# Altium schematic sheet main.SchDoc
size A4
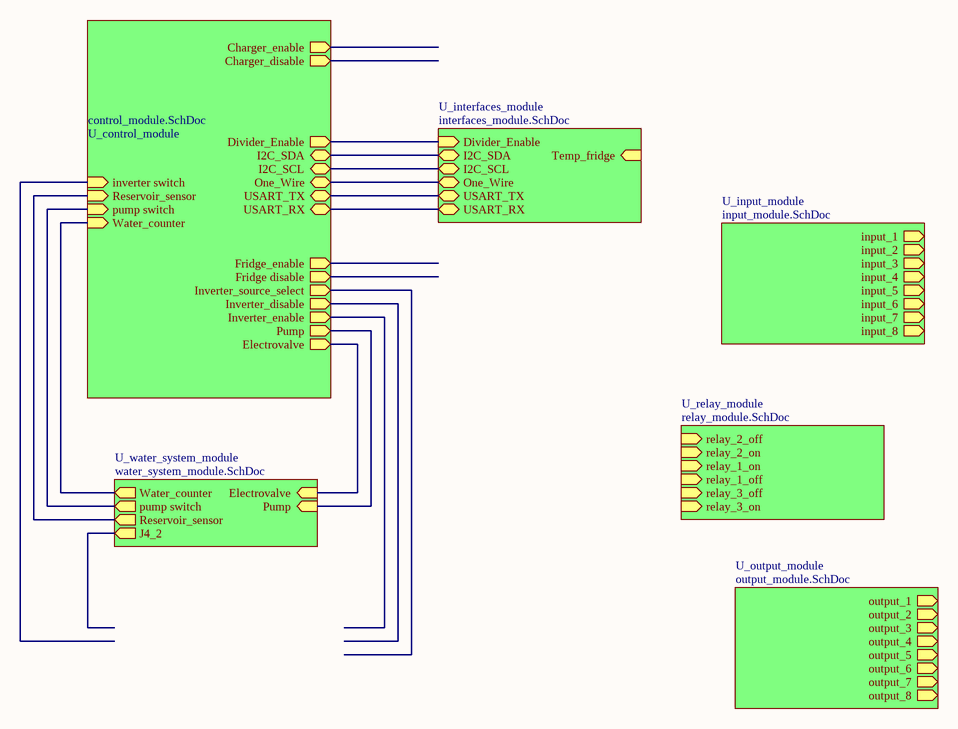
[diagram p0: main.SchDoc]

## Sub-sheets
U_control_module = control_module.SchDoc: Inverter_source_select (out), Inverter_enable (out), Fridge_enable (out), Water_counter (in), Inverter_disable (out), Fridge disable (out), I2C_SDA (bidir), USART_RX (bidir), USART_TX (bidir), pump switch (in), inverter switch (in), I2C_SCL (bidir), One_Wire (bidir), Divider_Enable (out), Charger_enable (out), Charger_disable (out), Reservoir_sensor (in), Electrovalve (out), Pump (out)
U_input_module = input_module.SchDoc: input_1 (out), input_2 (out), input_3 (out), input_4 (out), input_5 (out), input_6 (out), input_7 (out), input_8 (out)
U_interfaces_module = interfaces_module.SchDoc: Temp_fridge (in), I2C_SDA (bidir), I2C_SCL (bidir), One_Wire (bidir), USART_TX (bidir), USART_RX (bidir), Divider_Enable (in)
U_output_module = output_module.SchDoc: output_1 (out), output_2 (out), output_3 (out), output_4 (out), output_5 (out), output_6 (out), output_7 (out), output_8 (out)
U_relay_module = relay_module.SchDoc: relay_2_off (in), relay_2_on (in), relay_1_on (in), relay_1_off (in), relay_3_off (in), relay_3_on (in)
U_water_system_module = water_system_module.SchDoc: Water_counter (out), pump switch (out), J4_2 (out), Reservoir_sensor (out), Electrovalve (in), Pump (in)

## Nets
(unnamed): sheet U_control_module/Water_counter, sheet U_water_system_module/Water_counter
(unnamed): sheet U_control_module/I2C_SDA, sheet U_interfaces_module/I2C_SDA
(unnamed): sheet U_control_module/USART_RX, sheet U_interfaces_module/USART_RX
(unnamed): sheet U_control_module/USART_TX, sheet U_interfaces_module/USART_TX
(unnamed): sheet U_control_module/pump switch, sheet U_water_system_module/pump switch
(unnamed): sheet U_control_module/I2C_SCL, sheet U_interfaces_module/I2C_SCL
(unnamed): sheet U_control_module/One_Wire, sheet U_interfaces_module/One_Wire
(unnamed): sheet U_control_module/Divider_Enable, sheet U_interfaces_module/Divider_Enable
(unnamed): sheet U_control_module/Reservoir_sensor, sheet U_water_system_module/Reservoir_sensor
(unnamed): sheet U_control_module/Electrovalve, sheet U_water_system_module/Electrovalve
(unnamed): sheet U_control_module/Pump, sheet U_water_system_module/Pump